# Altium schematic sheet USB.SchDoc
size B; DocumentNumber: 4; SheetNumber: 4; SheetTotal: 8
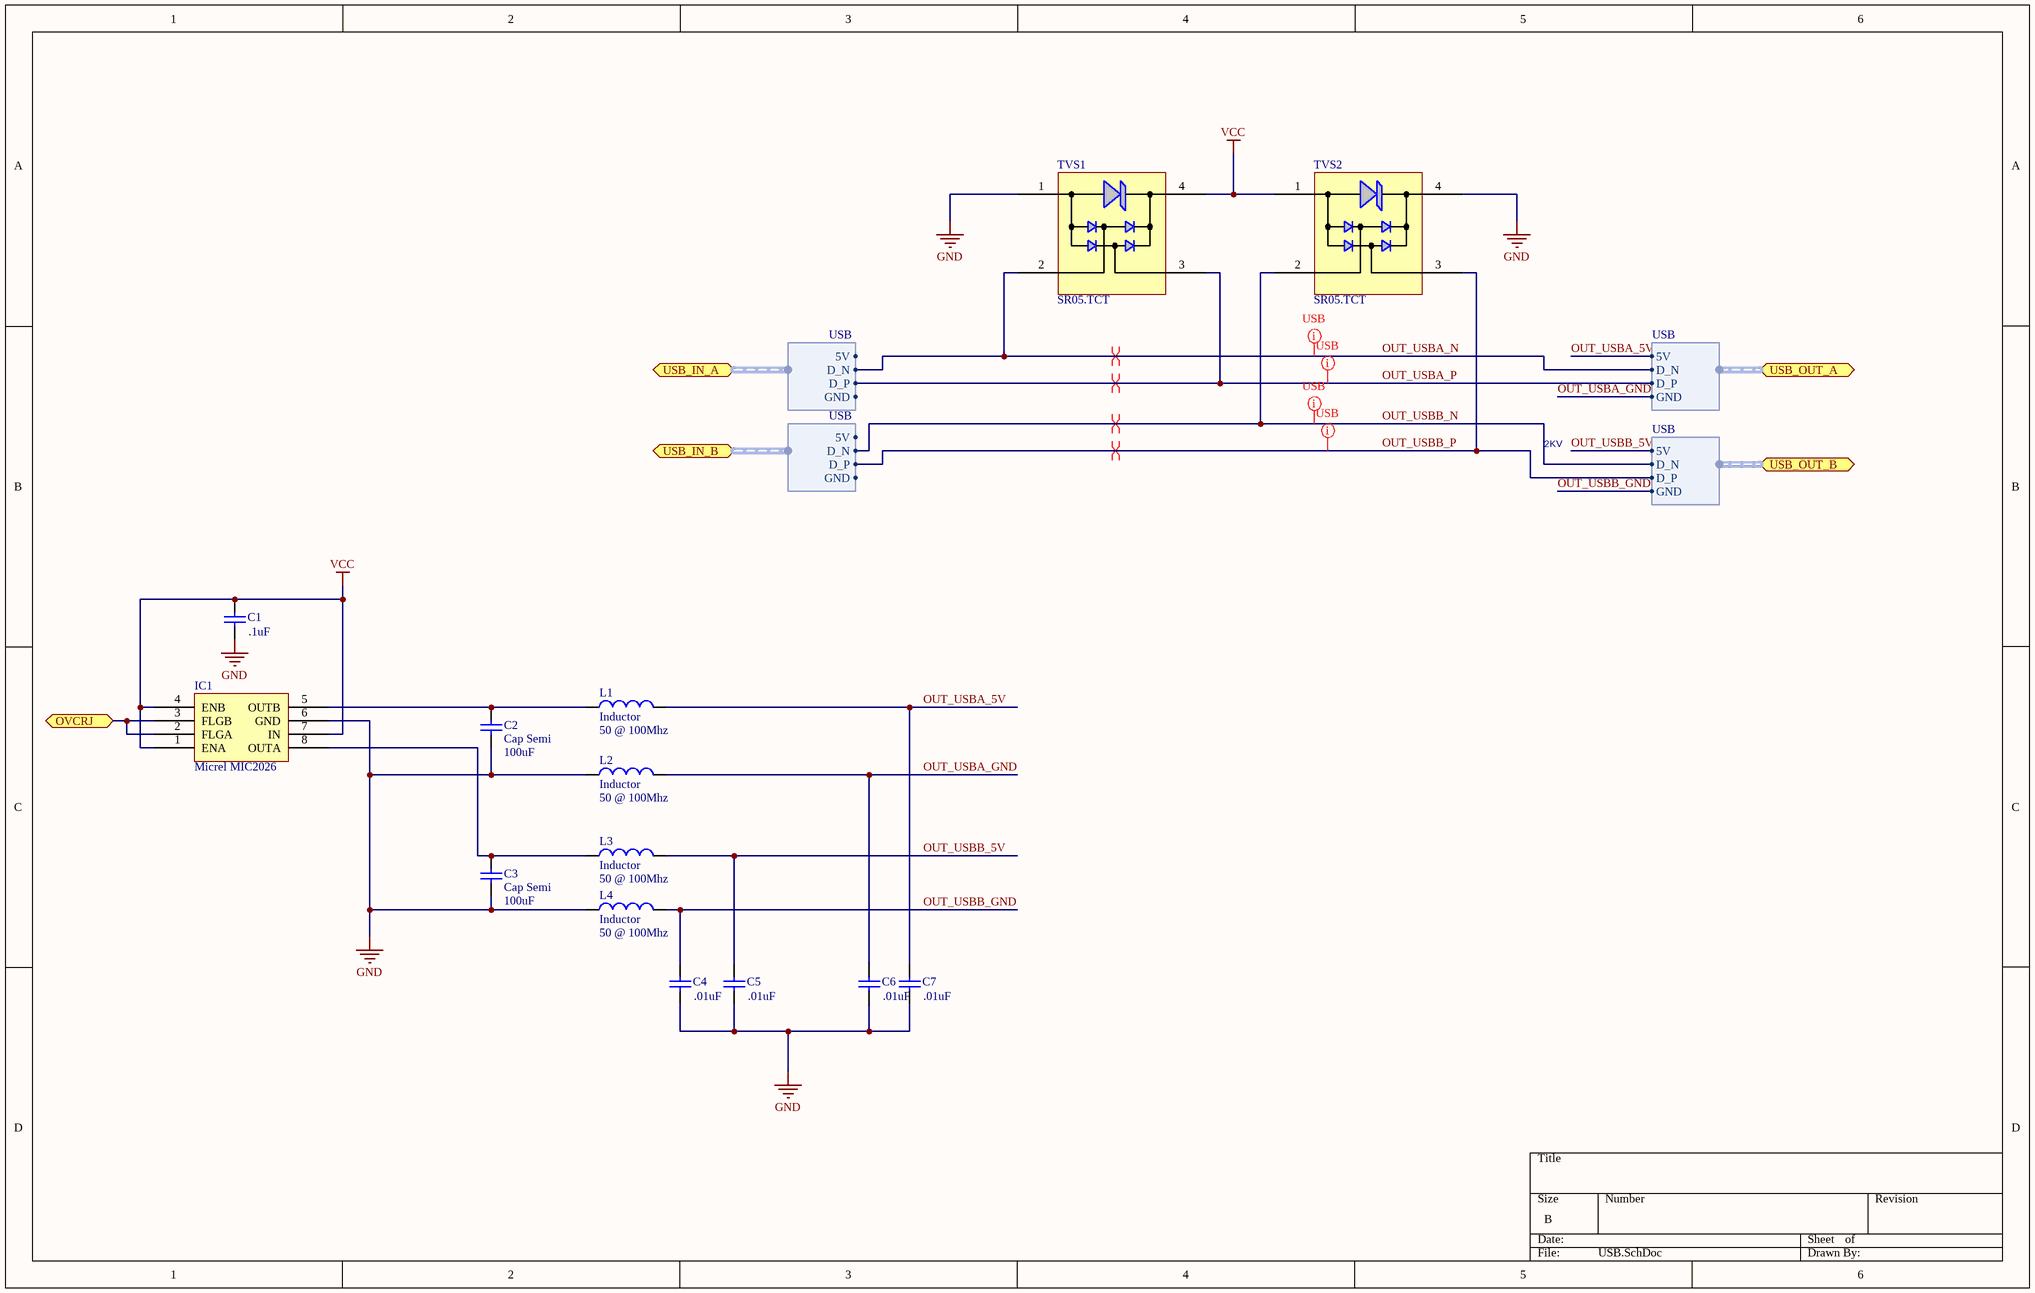
[diagram p0: USB.SchDoc]

## Parts
C1  value .1uF  [0402]  (hidden comment: Cap Semi)
C2  Cap Semi  value 100uF  [C1210]
C3  Cap Semi  value 100uF  [C1210]
C4  value .01uF  [0402]  (hidden comment: Cap Semi)
C5  value .01uF  [0402]  (hidden comment: Cap Semi)
C6  value .01uF  [0402]  (hidden comment: Cap Semi)
C7  value .01uF  [0402]  (hidden comment: Cap Semi)
IC1  Micrel MIC2026  [8-Pin SOIC]
L1  Inductor  value 50 @ 100Mhz  [0402-A]
L2  Inductor  value 50 @ 100Mhz  [0402-A]
L3  Inductor  value 50 @ 100Mhz  [0402-A]
L4  Inductor  value 50 @ 100Mhz  [0402-A]
TVS1  SR05.TCT  [SOT143]
TVS2  SR05.TCT  [SOT143]

## Ports
OVCRJ, USB_IN_A (harness USB), USB_IN_B (harness USB), USB_OUT_A (harness USB), USB_OUT_B (harness USB)

## Harnesses
USB: 5V, D_N, D_P, GND

## Nets
GND: C1.1 C2.1 C3.1 C4.1 C5.1 C6.1 C7.1 IC1.6(GND) L2.1 L4.1 TVS1.1 TVS2.4
VCC: C1.2 IC1.1(ENA) IC1.4(ENB) IC1.7(IN) TVS1.4 TVS2.1
OUT_USBA_5V: C7.2 L1.2 ; port USB_OUT_A.5V
OUT_USBA_GND: C6.2 L2.2 ; port USB_OUT_A.GND
OUT_USBA_N: TVS1.2 ; port USB_IN_A.D_N, port USB_OUT_A.D_N
OUT_USBA_P: TVS1.3 ; port USB_IN_A.D_P, port USB_OUT_A.D_P
OUT_USBB_5V: C5.2 L3.2 ; port USB_OUT_B.5V
OUT_USBB_GND: C4.2 L4.2 ; port USB_OUT_B.GND
OUT_USBB_N: TVS2.2 ; port USB_OUT_B.D_N, port USB_IN_B.D_N
OUT_USBB_P: TVS2.3 ; port USB_OUT_B.D_P, port USB_IN_B.D_P
OVCRJ: IC1.2(FLGA) IC1.3(FLGB) ; port OVCRJ
NetC2_2: C2.2 IC1.5(OUTB) L1.1
NetC3_2: C3.2 IC1.8(OUTA) L3.1

## Layout directives
differential pair: OUT_USBA_N, OUT_USBA_P, OUT_USBB_N, OUT_USBB_P
rule Differential Pairs Routing [Pref Gap = 6mil    Min Gap  = 6mil    Max Gap  = 7mil]; rule Width Constraint [Pref Width = 6mil    Min Width = 6mil    Max Width = 6mil]; rule Length Constraint [Min Length = 0mil    Max Length = 14000mil]; rule Matched Net Lengths [Tolerance = 150mil]: OUT_USBA_N, OUT_USBA_P, OUT_USBB_N, OUT_USBB_P

## Notes on the sheet
- 2KV

## Library data of the parts
C1-C7 = Cap Semi: Capacitor (Semiconductor SIM Model); Published: 8-Jun-2000; LatestRevisionDate: 17-Jul-2002; LatestRevisionNote: Re-released for DXP Platform.; PackageReference: C1206; Publisher: Altium Limited
IC1 = MIC2026: Micrel MIC2026 Dual-Channel Power Distribution Switch
L1-L4 = Inductor: Code_IEC: 1005; Published: 8-Jun-2000; LatestRevisionDate: 17-Jul-2002; LatestRevisionNote: Re-released for DXP Platform.; PackageReference: 0402-A; Publisher: Altium Limited; Code_JEITA: 0402
TVS1 TVS2 = SR05.TCT: IC TVS ARRAY 2-LINE 5V SOT-143